# Altium schematic sheet [11]-Motor Driver_DRV8701_2.SchDoc
size A4; Organization: Altium Limited; Address1: L3, 12a Rodborough Rd; Address2: Frenchs Forest; Address3: NSW; Address4: Australia 2086
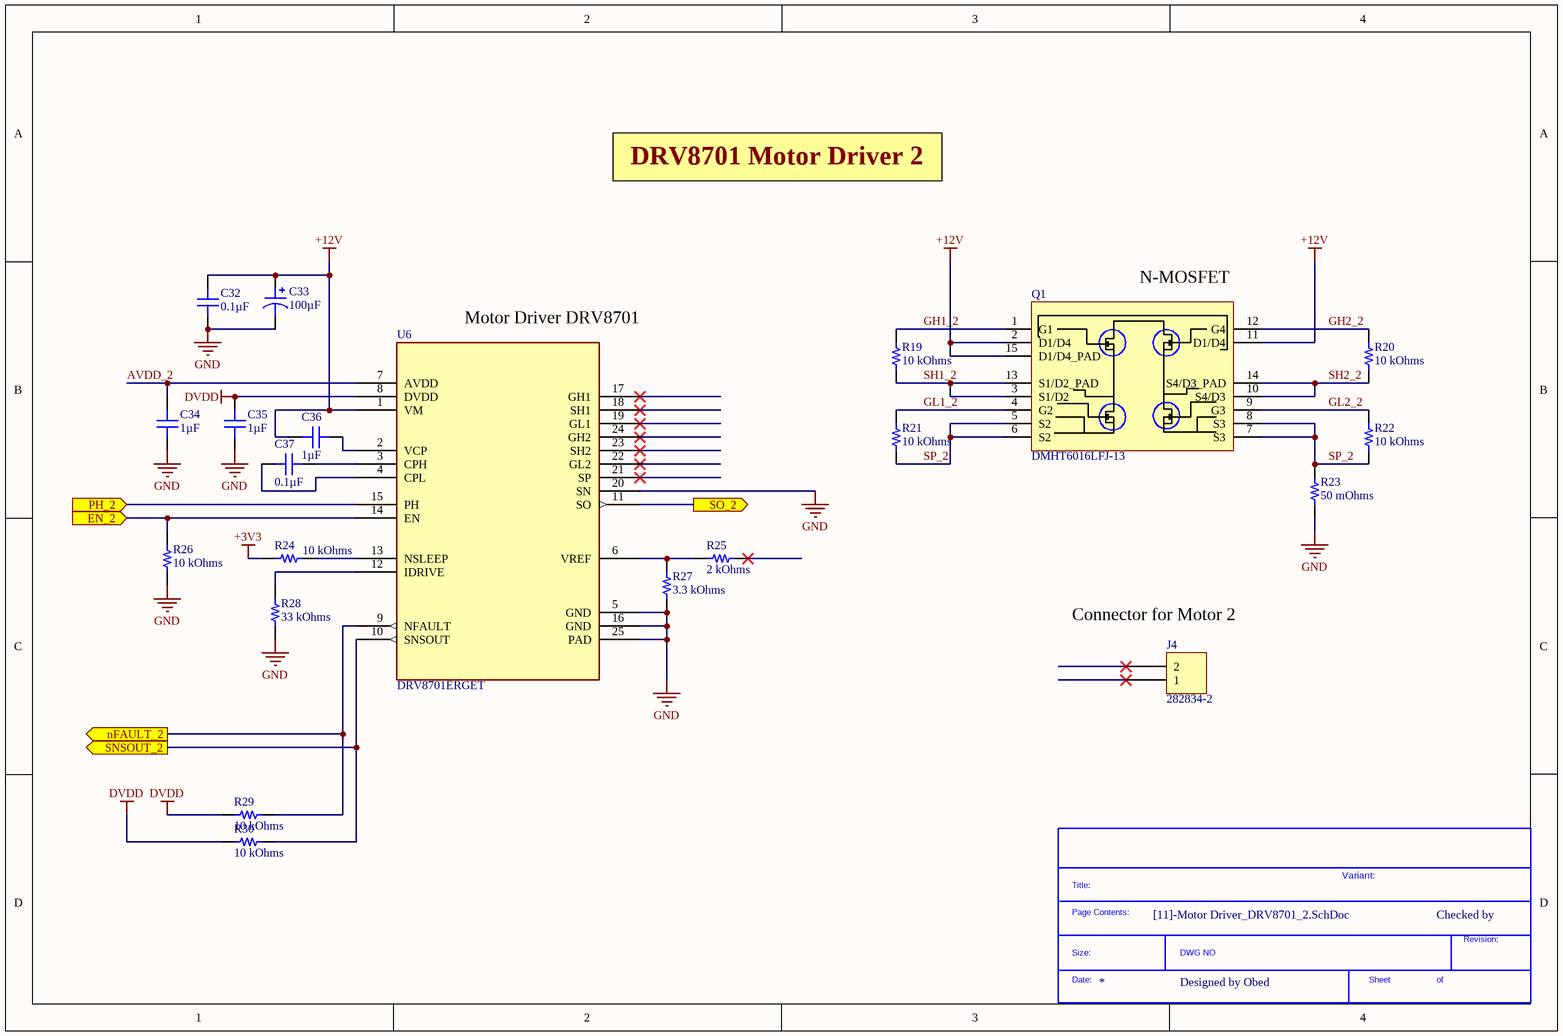
[diagram p0: [11]-Motor Driver_DRV8701_2.SchDoc]

## Parts
*?  SDTitleBlock  (value not drawn)  (graphical)
C32  0.1µF  [CAP 0805_2012]
C33  100µF  [CAP ALSMD 8.3MM H10.5MM]
C34  1µF  [CAP 0805_2012]
C35  1µF  [CAP 0805_2012]
C36  1µF  [CAP 0805_2012]
C37  0.1µF  [CAP 0805_2012]
J4  282834-2  [TE 282834-2]
Q1  DMHT6016LFJ-13  [DFN5045-12_33_212_27X15_SMD_1]
R19  10 kOhms  [RES 0805_2012]
R20  10 kOhms  [RES 0805_2012]
R21  10 kOhms  [RES 0805_2012]
R22  10 kOhms  [RES 0805_2012]
R23  50 mOhms  [RES 2512_6432]
R24  10 kOhms  [RES 0805_2012]
R25  2 kOhms  [RES 0603_1608]
R26  10 kOhms  [RES 0805_2012]
R27  3.3 kOhms  [RES 0603_1608]
R28  33 kOhms  [RES 0805_2012]
R29  10 kOhms  [RES 0805_2012]
R30  10 kOhms  [RES 0805_2012]
U6  DRV8701ERGET  [QFN50P400X400X100-25N]

## Ports
EN_2 (in), nFAULT_2 (out), PH_2 (in), SNSOUT_2 (out), SO_2 (out)

## Nets
+3V3: R24.1
+12V: C32.2 C33.1 C36.1 Q1.2(D1/D4) Q1.11(D1/D4) Q1.15(D1/D4_PAD) U6.1(VM)
DVDD: C35.2 R29.1 R30.1 U6.8(DVDD)
GND: C32.1 C33.2 C34.1 C35.1 R23.1 R26.1 R27.1 R28.1 U6.5(GND) U6.16(GND) U6.20(SN) U6.25(PAD)
AVDD_2: C34.2 U6.7(AVDD)
EN_2: R26.2 U6.14(EN) ; port EN_2
GH1_2: Q1.1(G1) R19.2
GH2_2: Q1.12(G4) R20.2
GL1_2: Q1.4(G2) R21.2
GL2_2: Q1.9(G3) R22.2
nFAULT_2: R29.2 U6.9(NFAULT) ; port nFAULT_2
PH_2: U6.15(PH) ; port PH_2
SH1_2: Q1.3(S1/D2) Q1.13(S1/D2_PAD) R19.1
SH2_2: Q1.10(S4/D3) Q1.14(S4/D3_PAD) R20.1
SNSOUT_2: R30.2 U6.10(SNSOUT) ; port SNSOUT_2
SO_2: U6.11(SO) ; port SO_2
SP_2: Q1.5(S2) Q1.6(S2) Q1.7(S3) Q1.8(S3) R21.1 R22.1 R23.2
NetC36_2: C36.2 U6.2(VCP)
NetC37_1: C37.1 U6.4(CPL)
NetC37_2: C37.2 U6.3(CPH)
NetR24_2: R24.2 U6.13(NSLEEP)
NetR25_1: R25.1 R27.2 U6.6(VREF)
NetR28_2: R28.2 U6.12(IDRIVE)

Not connected (* = marked no-connect by the designer): J4 1* 2*; R25 2*; U6 17(GH1)* 18(SH1)* 19(GL1)* 21(SP)* 22(GL2)* 23(SH2)* 24(GH2)*

## Notes on the sheet
- DRV8701 Motor Driver 2
- (near Q1) N-MOSFET
- Motor Driver DRV8701
- (near J4) Connector for Motor 2
- Variant:
- Checked by
- Designed by Obed
- Title
- Size:
- Date:
- File:
- A2
- Number:
- Time:
- Revision:
- Sheet
- of
- (in symbol SDTitleBlock) Title:; Page Contents:; Revision:; Size:; DWG NO; Date:; Sheet; of

## Library data of the parts
C32 C37 = 0805J0500104KXT: CAP CER 0.1UF 50V X7R 0805; Manufacturer: Knowles Syfer; Tolerance: ±10%; Part Number: 0805J0500104KXT; Applications: General Purpose; Capacitance: 0.1µF; ComponentLink1Description: Datasheet; ComponentLink1URL: https://www.knowlescapacitors.com/getattachment/2dbfc8bc-e2b3-4b4d-afb1-43b011b9ebe0/High-Std-Voltage.aspx; ComponentLink2Description: DigiKey Link; ComponentLink2URL: http://digikey.com/product-detail/en/knowles-syfer/0805J0500104KXT/1608-1000-1-ND/5730199; Device Package: 0805 (2012 Metric); LastUpdated: 02/09/2020 01:04:31; Lifecycle Status: Active; Minimum Order: 1; Mounting Type: Surface Mount, MLCC; Operating Temperature: -55°C ~ 125°C; Package / Case: 0805 (2012 Metric); Packaging: TapeAndReel; PartId: 8322; Part Status: Active; Price: 0.17; Series: -; Size / Dimension: 0.079" L x 0.049" W (2.00mm x 1.25mm); Supplier 1: DigiKey; Supplier Part Number 1: 1608-1000-1-ND; Temperature Coefficient: X7R; Thickness (Max): 0.051" (1.30mm); Voltage - Rated: 50V; Value: 0.1µF
C33 = EDT107M025A9MAA: CAP ALUM SMD 125C 100UF 25VDC; Manufacturer: KEMET; Lifetime @ Temp.: 2000 Hrs @ 125°C; Polarization: Polar; Ripple Current @ High Frequency: 156mA @ 10kHz; Ripple Current @ Low Frequency: 130mA @ 120Hz; Surface Mount Land Size: 0.327" L x 0.327" W (8.30mm x 8.30mm); Tolerance: ±20%; Voltage - Rated: 25V; Part Number: EDT107M025A9MAA; Applications: General Purpose; Capacitance: 100µF; ComponentLink1Description: Datasheet; ComponentLink1URL: https://api.kemet.com/component-edge/download/datasheet/EDT107M025A9MAA.pdf; ComponentLink2Description: DigiKey Link; ComponentLink2URL: http://digikey.com/product-detail/en/kemet/EDT107M025A9MAA/399-18156-1-ND/9354357; Device Package: Radial, Can - SMD; Height - Seated (Max): 0.413" (10.50mm); LastUpdated: 02/09/2020 01:25:14; Lifecycle Status: Active; Minimum Order: 1; Mounting Type: Surface Mount; Operating Temperature: -40°C ~ 125°C; Package / Case: Radial, Can - SMD; Packaging: TapeAndReel; PartId: 7637; Part Status: Active; Price: 0.23; Series: EDT; Size / Dimension: 0.315" Dia (8.00mm); Supplier 1: DigiKey; Supplier Part Number 1: 399-18156-1-ND; Value: 100µF
C34-C36 = 08055C105K4T2A: CAP CER 1UF 50V X7R 0805; Manufacturer: AVX Corporation; Tolerance: ±10%; Part Number: 08055C105K4T2A; Applications: Automotive; Capacitance: 1µF; ComponentLink1Description: Datasheet; ComponentLink1URL: http://datasheets.avx.com/AutoMLCC.pdf; ComponentLink2Description: DigiKey Link; ComponentLink2URL: http://digikey.com/product-detail/en/avx-corporation/08055C105K4T2A/478-9556-1-ND/5322894; Device Package: 0805 (2012 Metric); LastUpdated: 02/09/2020 01:04:35; Lifecycle Status: Active; Minimum Order: 1; Mounting Type: Surface Mount, MLCC; Operating Temperature: -55°C ~ 125°C; Package / Case: 0805 (2012 Metric); Packaging: TapeAndReel; PartId: 6460; Part Status: Active; Price: 0.08; Ratings: AEC-Q200; Series: -; Size / Dimension: 0.079" L x 0.049" W (2.00mm x 1.25mm); Supplier 1: DigiKey; Supplier Part Number 1: 478-9556-1-ND; Temperature Coefficient: X7R; Thickness (Max): 0.055" (1.40mm); Voltage - Rated: 50V; Value: 1µF
J4 = 282834-2: TERM BLK 2P SIDE ENT 2.54MM PCB; Manufacturer: TE Connectivity AMP Connectors; Current: 10A; Mating Orientation: Horizontal with Board; Number of Levels: 1; Pitch: 0.100" (2.54mm); Positions Per Level: 2; Voltage: 150V; Wire Gauge: 16-30 AWG; Wire Termination: Screw - Rising Cage Clamp; Part Number: 282834-2; Color: Green; ComponentLink1Description: Datasheet; ComponentLink1URL: https://www.te.com/commerce/DocumentDelivery/DDEController?Action=srchrtrv&DocNm=282834&DocType=Customer+Drawing&DocLang=English; ComponentLink2Description: DigiKey Link; ComponentLink2URL: http://digikey.com/product-detail/en/te-connectivity-amp-connectors/282834-2/A98333-ND/1150135; LastUpdated: 15/01/2020 04:15:38; Lifecycle Status: Active; Minimum Order: 1; Mounting Type: Through Hole; Packaging: Bulk; Part Status: Active; Price: 0.88; Series: Buchanan; Supplier 1: DigiKey; Supplier Part Number 1: A98333-ND
Q1 = MOSFET-N_60V-14.8A-V-DFN5045-12: Mosfet Array 4 N-Channel 14.8A (Ta) Surface Mount V-DFN5045-12; Manufacturer: Diodes; Supplier 1: Digi-Key; Manufacturer Part Number: DMHT6016LFJ-13; Category: MOSFETs; Pricing 1: 1=1.65000, 10=1.48400, 25=1.40040, 100=1.19310, 500=0.98020, 1000=0.81217 (USD); Mount: Surface Mount; Packaging: Tape and Reel; ComponentLink1URL: https://www.diodes.com/assets/Datasheets/DMHT6016LFJ.pdf?src-supplier=Digi-Key; ComponentLink1Description: https://www.diodes.com/assets/Datasheets/DMHT6016LFJ.pdf?src-supplier=Digi-Key; Supplier Part Number 1: DMHT6016LFJ-13DICT-ND
R19-R22 R24 R26 R29 R30 = CRCW080510K0FKEA: RES SMD 10K OHM 1% 1/8W 0805; Manufacturer: Vishay Dale; Power (Watts): 0.125W, 1/8W; Temperature Coefficient: ±100ppm/°C; Part Number: CRCW080510K0FKEA; ComponentLink1Description: Datasheet; ComponentLink1URL: http://www.vishay.com/docs/20035/dcrcwe3.pdf; ComponentLink2Description: DigiKey Link; ComponentLink2URL: http://digikey.com/product-detail/en/vishay-dale/CRCW080510K0FKEA/541-10.0KCCT-ND/1180897; Composition: Thick Film; Device Package: 0805 (2012 Metric); Features: Automotive AEC-Q200; Height - Seated (Max): 0.020" (0.50mm); LastUpdated: 02/09/2020 01:15:23; Lifecycle Status: Active; Minimum Order: 1; Number of Terminations: 2; Operating Temperature: -55°C ~ 155°C; Package / Case: 0805 (2012 Metric); Packaging: TapeAndReel; PartId: 28101; Part Status: Active; Price: 0.01; Ratings: AEC-Q200; Resistance: 10 kOhms; Series: CRCW; Size / Dimension: 0.079" L x 0.049" W (2.00mm x 1.25mm); Supplier 1: DigiKey; Supplier Part Number 1: 541-10.0KCCT-ND; Supplier Device Package: 0805; Tolerance: ±1%; Value: 10 kOhms
R23 = PA2512FKF7W0R05E: METAL CURRENT SENSOR 2512 1% 100; Manufacturer: Yageo; Power (Watts): 2W; Temperature Coefficient: ±100ppm/°C; Part Number: PA2512FKF7W0R05E; ComponentLink1Description: Datasheet; ComponentLink1URL: http://www.yageo.com/documents/recent/PYu-PA_E_51_RoHS_10.pdf; ComponentLink2Description: DigiKey Link; ComponentLink2URL: http://digikey.com/product-detail/en/yageo/PA2512FKF7W0R05E/YAG6100CT-ND/9696554; Composition: Metal Element; Device Package: 2512 (6432 Metric); Features: Automotive AEC-Q200, Current Sense, Moisture Resistant; Height - Seated (Max): 0.035" (0.88mm); LastUpdated: 02/09/2020 01:26:58; Lifecycle Status: Active; Minimum Order: 1; Number of Terminations: 2; Operating Temperature: -55°C ~ 170°C; Package / Case: 2512 (6432 Metric); Packaging: TapeAndReel; Part Status: Active; Price: 0.20; Ratings: AEC-Q200; Resistance: 50 mOhms; Series: PA_E; Size / Dimension: 0.250" L x 0.125" W (6.35mm x 3.18mm); Supplier 1: DigiKey; Supplier Part Number 1: YAG6100CT-ND; Supplier Device Package: 2512; Tolerance: ±1%; Value: 50 mOhms
R25 = RMCF0603FT2K00: RES 2K OHM 1% 1/10W 0603; Manufacturer: Stackpole Electronics Inc; Power (Watts): 0.1W, 1/10W; Temperature Coefficient: ±100ppm/°C; Part Number: RMCF0603FT2K00; ComponentLink1Description: Datasheet; ComponentLink1URL: https://www.seielect.com/catalog/sei-rmcf_rmcp.pdf; ComponentLink2Description: DigiKey Link; ComponentLink2URL: http://digikey.com/product-detail/en/stackpole-electronics-inc/RMCF0603FT2K00/RMCF0603FT2K00CT-ND/1943009; Composition: Thick Film; Device Package: 0603 (1608 Metric); Features: Automotive AEC-Q200; Height - Seated (Max): 0.022" (0.55mm); LastUpdated: 02/09/2020 01:10:22; Lifecycle Status: Active; Minimum Order: 1; Number of Terminations: 2; Operating Temperature: -55°C ~ 155°C; Package / Case: 0603 (1608 Metric); Packaging: CutTape; PartId: 6085; Part Status: Active; Price: 0.10; Ratings: AEC-Q200; Resistance: 2 kOhms; Series: RMCF; Size / Dimension: 0.061" L x 0.031" W (1.55mm x 0.80mm); Supplier 1: DigiKey; Supplier Part Number 1: RMCF0603FT2K00CT-ND; Supplier Device Package: 0603; Tolerance: ±1%; Value: 2 kOhms
R27 = CRGP0603F3K3: CRGP 0603 3K3 1%; Manufacturer: TE Connectivity Passive Product; Power (Watts): 0.25W, 1/4W; Temperature Coefficient: ±100ppm/°C; Part Number: CRGP0603F3K3; ComponentLink1Description: Datasheet; ComponentLink1URL: https://www.te.com/commerce/DocumentDelivery/DDEController?Action=srchrtrv&DocNm=9-1773463-9&DocType=DS&DocLang=English; ComponentLink2Description: DigiKey Link; ComponentLink2URL: http://digikey.com/product-detail/en/te-connectivity-passive-product/CRGP0603F3K3/A130422CT-ND/8578254; Composition: Thick Film; Device Package: 0603 (1608 Metric); Features: Pulse Withstanding; Height - Seated (Max): 0.022" (0.55mm); LastUpdated: 02/09/2020 01:10:24; Lifecycle Status: Active; Minimum Order: 1; Number of Terminations: 2; Operating Temperature: -55°C ~ 155°C; Package / Case: 0603 (1608 Metric); Packaging: TapeAndReel; PartId: 5037; Part Status: Active; Price: 0.02; Resistance: 3.3 kOhms; Series: CRGP; Size / Dimension: 0.063" L x 0.031" W (1.60mm x 0.80mm); Supplier 1: DigiKey; Supplier Part Number 1: A130422CT-ND; Supplier Device Package: 0603; Tolerance: ±1%; Value: 3.3 kOhms
R28 = RMCF0805FT33K0: RES 33K OHM 1% 1/8W 0805; Manufacturer: Stackpole Electronics Inc; Power (Watts): 0.125W, 1/8W; Temperature Coefficient: ±100ppm/°C; Part Number: RMCF0805FT33K0; ComponentLink1Description: Datasheet; ComponentLink1URL: https://www.seielect.com/catalog/sei-rmcf_rmcp.pdf; ComponentLink2Description: DigiKey Link; ComponentLink2URL: http://digikey.com/product-detail/en/stackpole-electronics-inc/RMCF0805FT33K0/RMCF0805FT33K0CT-ND/1942464; Composition: Thick Film; Device Package: 0805 (2012 Metric); Features: Automotive AEC-Q200; Height - Seated (Max): 0.026" (0.65mm); LastUpdated: 02/09/2020 01:15:14; Lifecycle Status: Active; Minimum Order: 1; Number of Terminations: 2; Operating Temperature: -55°C ~ 155°C; Package / Case: 0805 (2012 Metric); Packaging: CutTape; PartId: 32416; Part Status: Active; Price: 0.10; Ratings: AEC-Q200; Resistance: 33 kOhms; Series: RMCF; Size / Dimension: 0.079" L x 0.049" W (2.00mm x 1.25mm); Supplier 1: DigiKey; Supplier Part Number 1: RMCF0805FT33K0CT-ND; Supplier Device Package: 0805; Tolerance: ±1%; Value: 33 kOhms
U6 = IC_DRV8701ERGET: IC MOTOR DRIVER 0V-5.5V 24VQFN; Manufacturer: Texas Instruments; Supplier 1: Digi-Key; Manufacturer Part Number: DRV8701ERGET; Category: Integrated Circuits (ICs); Pricing 1: 1=2.52000, 10=2.26100, 25=2.13320, 100=1.81750 (USD); Mount: Surface Mount; Case/Package: VQFN; ComponentLink1URL: http://www.ti.com/general/docs/lit/getliterature.tsp?genericPartNumber=DRV8701&&fileType=pdf&src-supplier=Avnet; ComponentLink1Description: http://www.ti.com/general/docs/lit/getliterature.tsp?genericPartNumber=DRV8701&&fileType=pdf&src-supplier=Avnet; ComponentLink2URL: http://www.ti.com/lit/ds/symlink/drv8701.pdf?src-supplier=Digi-Key; ComponentLink2Description: http://www.ti.com/lit/ds/symlink/drv8701.pdf?src-supplier=Digi-Key